# Altium project Power_board.PrjPcb
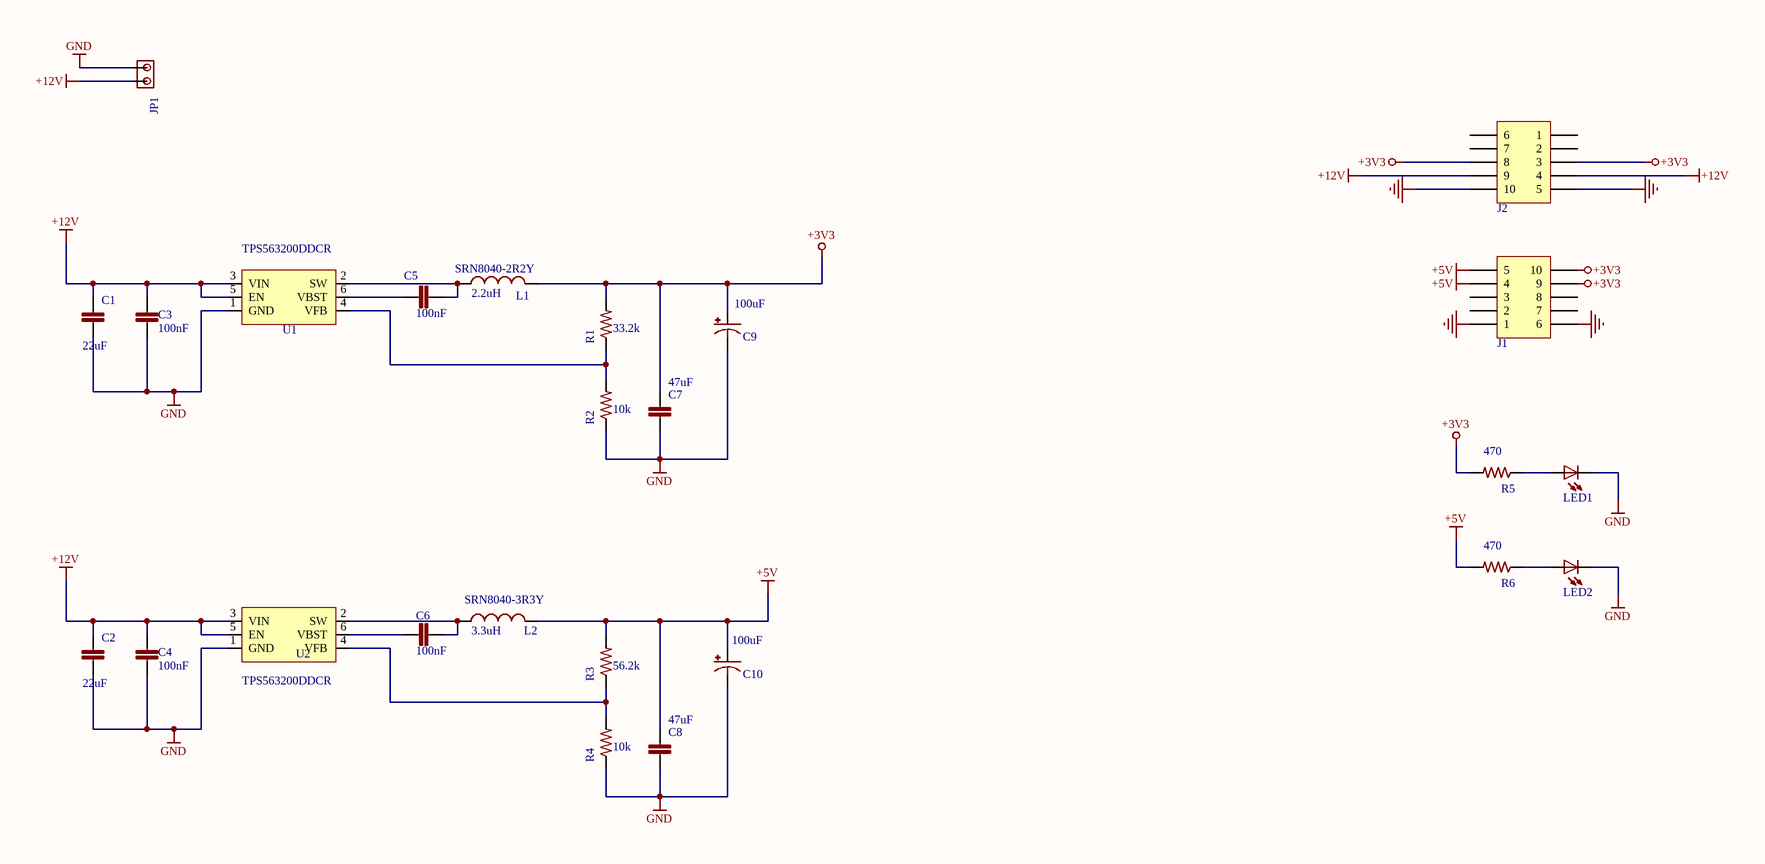
[diagram p0: Power_board.SchDoc]
<Author>: Leandro Pereira; <CompanyName>: Time Energy; <ProjectName>: Power Board; <Revision>: 0.1; <SheetTotal>: 1
1 sheet, 25 parts. Net scope: global (net labels, ports and power ports of the same name join across sheets).
Board file: Power_board.PcbDoc

## Sheet Power_board.SchDoc: Communication Board
size A3; SheetNumber: 1

### Parts
C1  value 22uF  [C1206K]  (hidden comment: Ceramic capacitor)
C2  value 22uF  [C1206K]  (hidden comment: Ceramic capacitor)
C3  value 100nF  [C0603]  (hidden comment: C-EUC0603)
C4  value 100nF  [C0603]  (hidden comment: C-EUC0603)
C5  value 100nF  [C0603]  (hidden comment: C-EUC0603)
C6  value 100nF  [C0603]  (hidden comment: C-EUC0603)
C7  value 47uF  [C1206K]  (hidden comment: Capacitor)
C8  value 47uF  [C1206K]  (hidden comment: Capacitor)
C9  value 100uF  [153CLV-0505]
C10  value 100uF  [153CLV-0505]
J1  10p  [61301021121]  (value not drawn)
J2  10p  [61301021121]  (value not drawn)
JP1  CONECT_BAT  [CONECT_BAT_PCK]  (value not drawn)
L1  value 2.2uH  Part number: SRN8040-2R2Y  [SRN8040]  (hidden comment: SRN8040)
L2  value 3.3uH  Part number: SRN8040-3R3Y  [SRN8040]  (hidden comment: SRN8040)
LED1  LEDCHIPLED_0805  [CHIPLED_0805]  (value not drawn)
LED2  LEDCHIPLED_0805  [CHIPLED_0805]  (value not drawn)
R1  33.2k  [R0603]
R2  10k  [R0603]
R3  56.2k  [R0603]
R4  10k  [R0603]
R5  value 470  [R0603]
R6  value 470  [R0603]
U1  Part number: TPS563200DDCR  [DBV0006A_N]  (hidden comment: TPS563200)
U2  Part number: TPS563200DDCR  [DBV0006A_N]  (hidden comment: TPS563200)

### Nets
+3V3: C7.1 C9.+ J1.9 J1.10 J2.3 J2.8 L1.2 R1.2 R5.2
+5V: C8.1 C10.+ J1.4 J1.5 L2.2 R3.2 R6.2
+12V: C1.1 C2.1 C3.1 C4.1 J2.4 J2.9 JP1.2 U1.3(VIN) U1.5(EN) U2.3(VIN) U2.5(EN)
GND: C1.2 C2.2 C3.2 C4.2 C7.2 C8.2 C9.- C10.- J1.1 J1.6 J2.5 J2.10 JP1.1 LED1.C LED2.C R2.1 R4.1 U1.1(GND) U2.1(GND)
NetC5_1: C5.1 U1.6(VBST)
NetC5_2: C5.2 L1.1 U1.2(SW)
NetC6_1: C6.1 U2.6(VBST)
NetC6_2: C6.2 L2.1 U2.2(SW)
NetLED1_A: LED1.A R5.1
NetLED2_A: LED2.A R6.1
NetR1_1: R1.1 R2.2 U1.4(VFB)
NetR3_1: R3.1 R4.2 U2.4(VFB)

Not connected (* = marked no-connect by the designer): J1 2 3 7 8; J2 1 2 6 7

### Notes on the sheet
- Projeto:
- Data:
- Subtítulo:
- Folha:
- Revisão:

### Library data of the parts
C1 C2 = C-EUC1206K: CAPACITOR, European symbol; Part number: GRM31CR61E226ME15K; Vendor: Murata; Família: Capacitor
C3-C6 = C-EUC0603: Part Number: 06033C104KAT2A; Vendor: AVX; Família: Capacitor
C7 C8 = C-EUC1206K: CAPACITOR, European symbol; Part number: GRM31CR61A476KE15L; Vendor: Murata; Família: Capacitor
C9 C10 = CPOL-US153CLV-0505: Part Number: UWR1A101MCL1GB; Vendor: Nichicon; Família: Capacitor
J1 J2 = 61301021121: WR-PHD 2.54 mm THT Dual Pin Header, 10p; Vendor: Wurth Elektronik; Part Number: 61301021121; Value: 10p
L1 L2 = SRN8040: Imported; Vendor: Bourns; Família: Indutor
R1 = R-US_R0603: RESISTOR, American symbol; Part number: RR0816P-3322-D-51C; Vendor: Susumu; Value: 33.2k; Família: Resistor
R2 R4 = R-US_R0603: RESISTOR, American symbol; Part number: RC0603FR-0710KL; Vendor: Yageo; Value: 10k; Família: Resistor
R3 = R-US_R0603: RESISTOR, American symbol; Part number: RR0816P-5622-D-73C; Vendor: Susumu; Value: 56.2k; Família: Resistor
R5 R6 = R-US_R0603: RESISTOR, American symbol; Part number: ERJ-3GEYJ471V; Vendor: Panasonic; Família: Resistor
U1 U2 = TPS563200: Vendor: Texas Instruments; Família: Cis